# EAGLE design Hazard Beacon Timer (EAGLE 9.6.2)
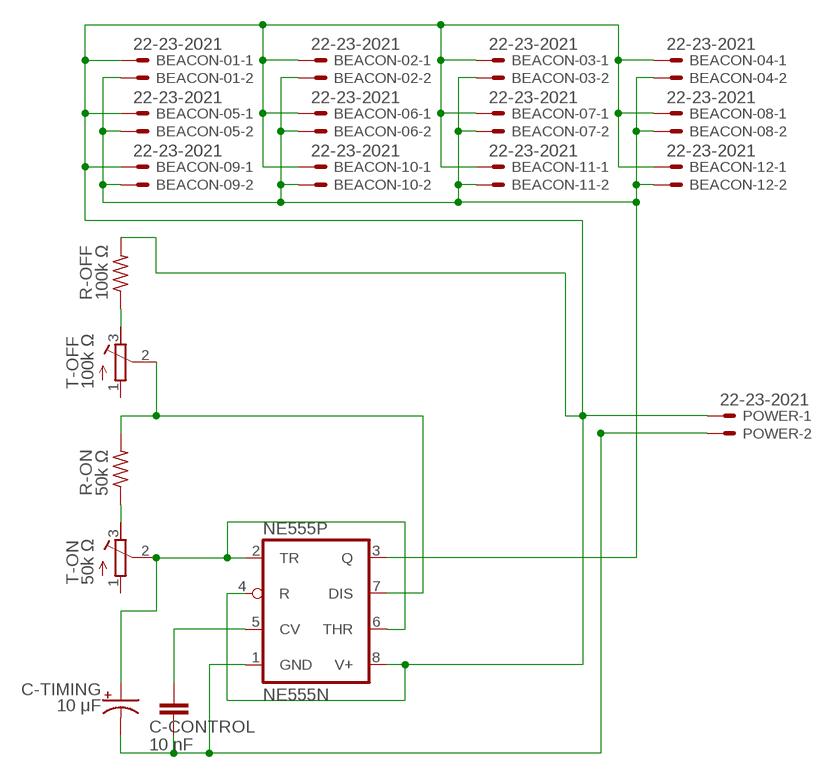
[diagram p0: schematic, sheet 1]

## Parts
BEACON-01  22-23-2021  [22-23-2021]
BEACON-02  22-23-2021  [22-23-2021]
BEACON-03  22-23-2021  [22-23-2021]
BEACON-04  22-23-2021  [22-23-2021]
BEACON-05  22-23-2021  [22-23-2021]
BEACON-06  22-23-2021  [22-23-2021]
BEACON-07  22-23-2021  [22-23-2021]
BEACON-08  22-23-2021  [22-23-2021]
BEACON-09  22-23-2021  [22-23-2021]
BEACON-10  22-23-2021  [22-23-2021]
BEACON-11  22-23-2021  [22-23-2021]
BEACON-12  22-23-2021  [22-23-2021]
C-CONTROL  10 nF  C2.5/2  [C2.5-2]
C-TIMING  10 μF  CPOL-USE2-5  [E2-5]
NE555P  NE555N  [DIL08]
POWER  22-23-2021  [22-23-2021]
R-OFF  100k Ω  R-US_0207/7  [0207/7]
R-ON  50k Ω  R-US_0207/7  [0207/7]
T-OFF  100k Ω  R-TRIMM5X  [RTRIM5X]
T-ON  50k Ω  R-TRIMM5X  [RTRIM5X]

## Nets
N$1: C-CONTROL.1 NE555P.5(CV)
N$2: R-ON.1 T-ON.3(E)
N$3: NE555P.7(DIS) R-ON.2 T-OFF.2(S)
N$4: BEACON-01.1 BEACON-02.1 BEACON-03.1 BEACON-04.1 BEACON-05.1 BEACON-06.1 BEACON-07.1 BEACON-08.1 BEACON-09.1 BEACON-10.1 BEACON-11.1 BEACON-12.1 NE555P.4(R) NE555P.8(V+) POWER.1 R-OFF.2
N$5: R-OFF.1 T-OFF.3(E)
N$7: BEACON-01.2 BEACON-02.2 BEACON-03.2 BEACON-04.2 BEACON-05.2 BEACON-06.2 BEACON-07.2 BEACON-08.2 BEACON-09.2 BEACON-10.2 BEACON-11.2 BEACON-12.2 NE555P.3(Q)
N$8: C-TIMING.+ NE555P.2(TR) NE555P.6(THR) T-ON.2(S)
N$11: C-CONTROL.2 C-TIMING.- NE555P.1(GND) POWER.2
Unconnected: T-OFF.1(A) T-ON.1(A)

## Library data of the parts
BEACON-01-BEACON-09 BEACON-10-BEACON-12 POWER = con-molex:22-23-2021: .100" (2.54mm) Center Header - 2 Pin; MF: MOLEX; MPN: 22-23-2021; OC_FARNELL: 1462926; OC_NEWARK: 25C3832
C-CONTROL = capacitor-wima:C: CAPACITOR naming: grid - package width
C-TIMING = rcl:CPOL-US: POLARIZED CAPACITOR, American symbol; SPICEPREFIX: C
NE555P = linear:*555: TIMER
R-OFF R-ON = rcl:R-US_: RESISTOR, American symbol; SPICEPREFIX: R
T-OFF T-ON = rcl:R-TRIMM: Trimm resistor; SPICEMODEL: X; SPICEPREFIXL: POT

## Board
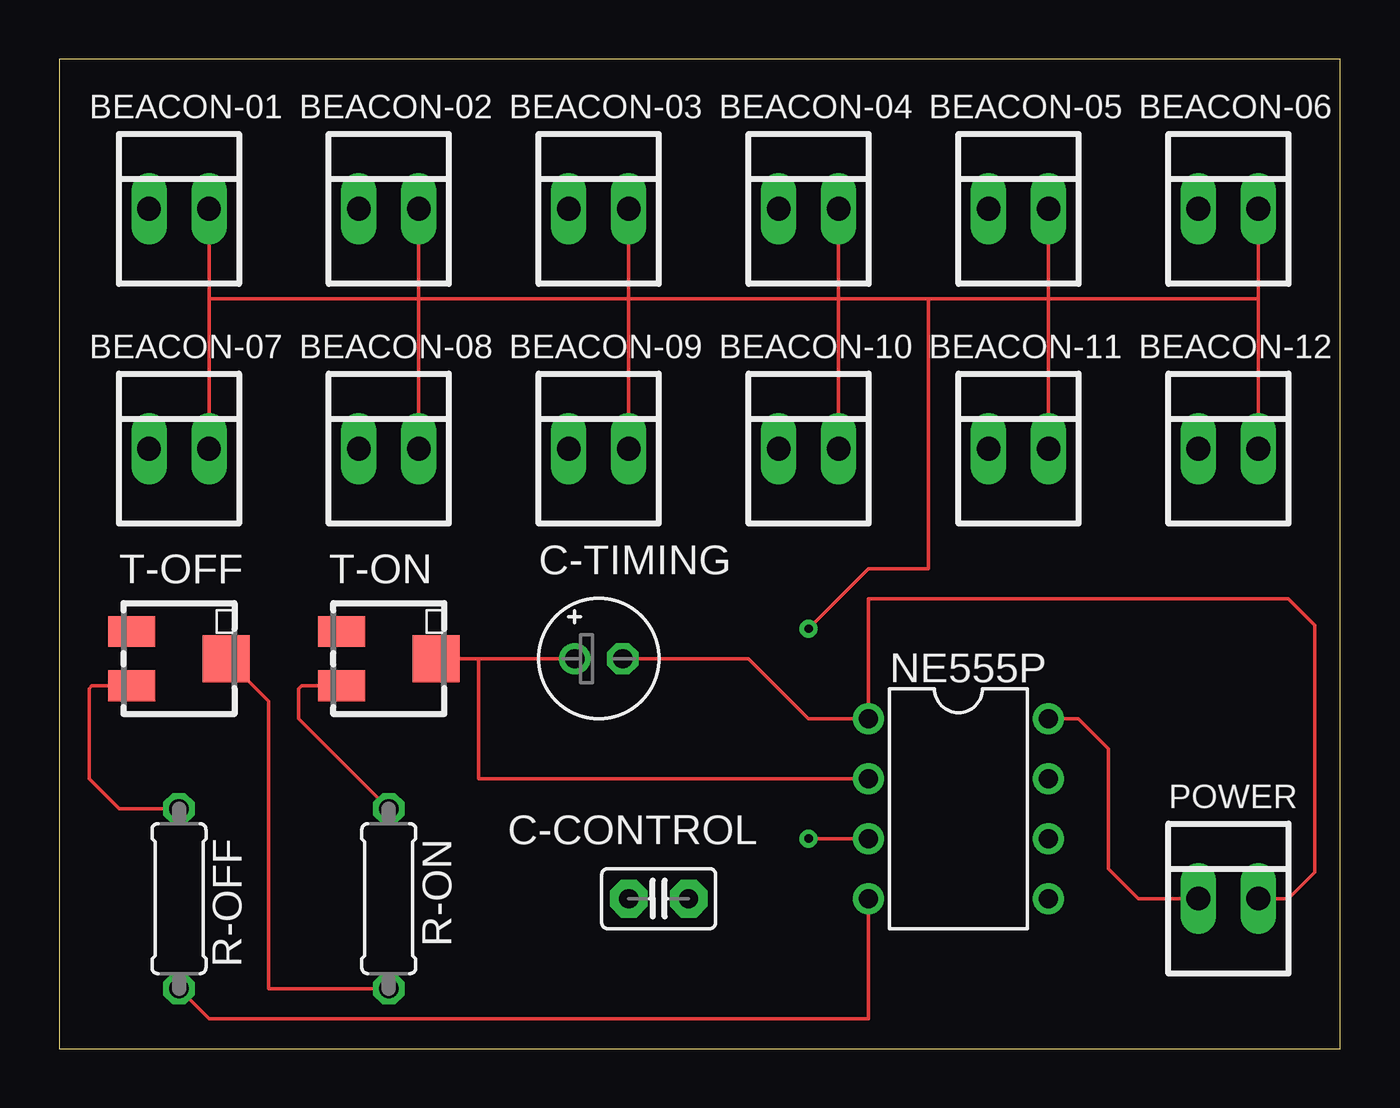
[diagram p1: board, top side]
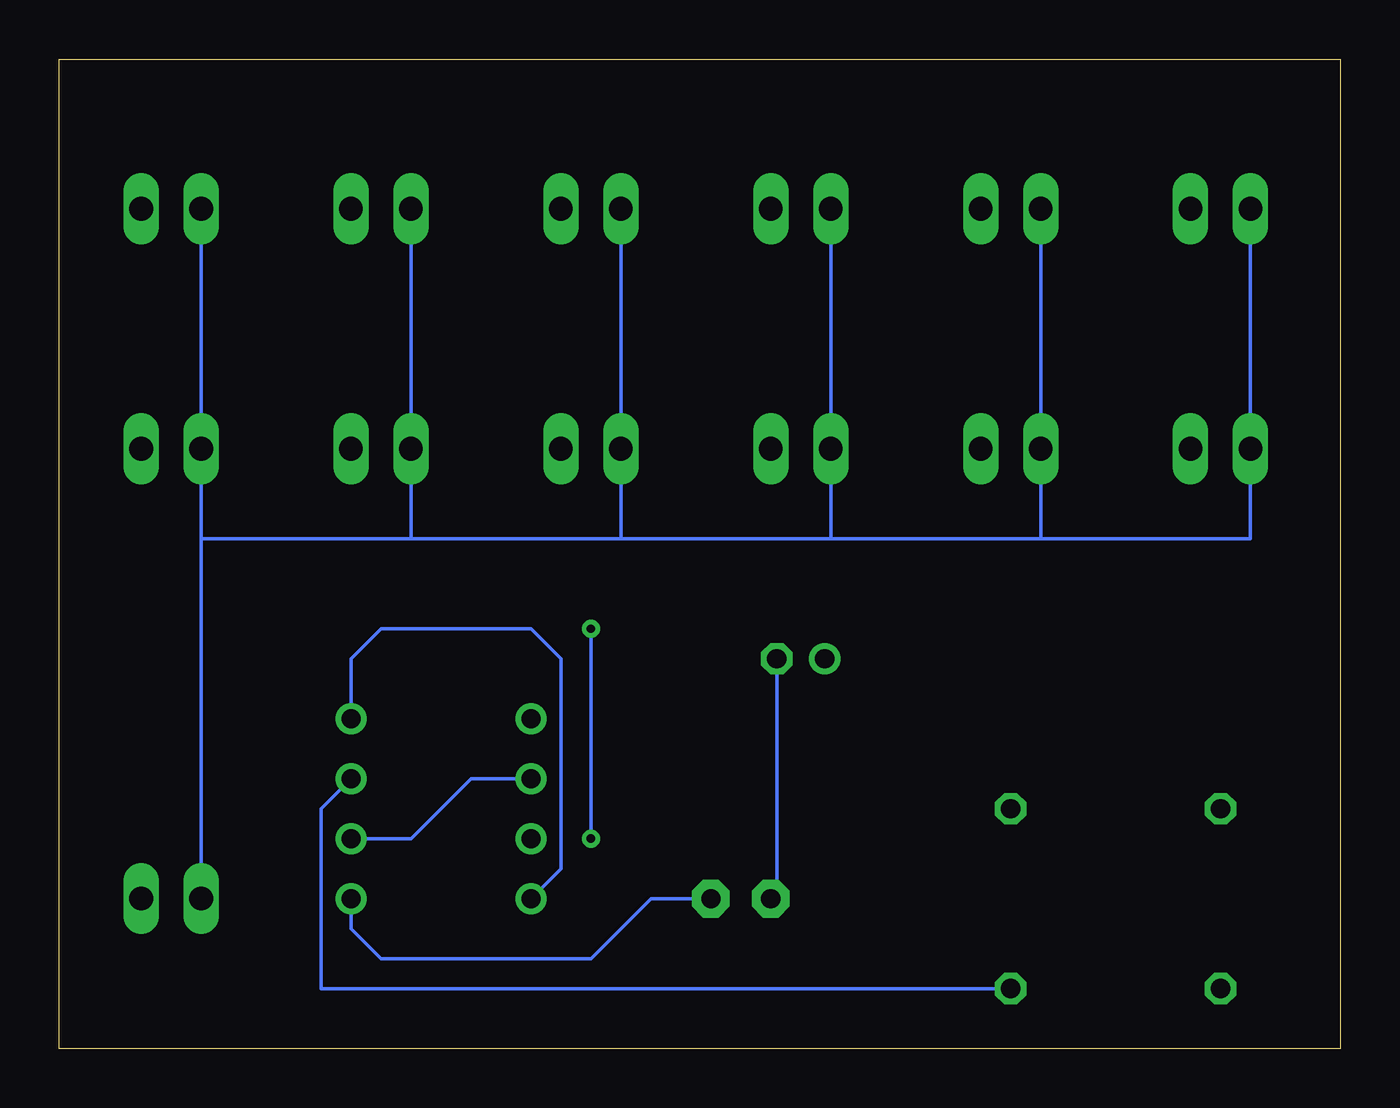
[diagram p2: board, bottom side, seen from below]

Size 54.28 x 41.9 mm. Coordinates in mm from the lower left corner, seen from the top.
Outline: 0,0 54.28,0 54.28,41.9 0,41.9 0,0
Copper layers (1*16): Top 0.035mm / dielectric 1.5mm / Bottom 0.035mm
Design rules "default": minimum track width 6mil, minimum drill 0.35mm, track to track 6mil, track to pad 6mil, pad to pad 6mil, via to via 6mil, smd to smd 6mil, copper to edge 40mil, drill to drill 6mil, minimum pad ring 10mil, minimum via ring 8mil, stop-mask expansion 4mil, vias tented up to drill 0mil, thermal gap 10mil

### Footprints (pad centres in the part's own frame; a part is rotated, then mirrored left to right if it is on the bottom)
22-23-2021 = drill 1 long: 1 -1.27,0; 2 1.27,0
C2.5-2 = drill 0.813 pad 1.6 octagon: 1 -1.27,0; 2 1.27,0
E2-5 = drill 0.813 pad 1.27: + -1.016,0 | drill 0.813 pad 1.27 octagon: - 1.016,0
DIL08 = drill 0.813 pad 1.27: 1 -3.81,-3.81; 2 -1.27,-3.81; 3 1.27,-3.81; 4 3.81,-3.81; 5 3.81,3.81; 6 1.27,3.81; 7 -1.27,3.81; 8 -3.81,3.81
0207/7 = drill 0.813 octagon: 1 -3.81,0; 2 3.81,0
RTRIM5X = smd 1.3 x 2: 1 -1.15,-2; 3 1.15,-2 | smd 2 x 2: 2 0,2

### Placement (x,y rotation side)
BEACON-01  5.08,35.56 0 top
BEACON-02  13.97,35.56 0 top
BEACON-03  22.86,35.56 0 top
BEACON-04  31.75,35.56 0 top
BEACON-05  40.64,35.56 0 top
BEACON-06  49.53,35.56 0 top
BEACON-07  5.08,25.4 0 top
BEACON-08  13.97,25.4 0 top
BEACON-09  22.86,25.4 0 top
BEACON-10  31.75,25.4 0 top
BEACON-11  40.64,25.4 0 top
BEACON-12  49.53,25.4 0 top
C-CONTROL  25.4,6.35 180 top
C-TIMING  22.86,16.51 0 top
NE555P  38.1,10.16 270 top
POWER  49.53,6.35 0 top
R-OFF  5.08,6.35 270 top
R-ON  13.97,6.35 270 top
T-OFF  5.08,16.51 270 top
T-ON  13.97,16.51 270 top

### Tracks (layer width: path | path; a pad name or v marks a point on that pad's centre or on a via)
N$1
  Bottom 0.152: C-CONTROL.1 29.21,6.35 31.75,3.81 40.64,3.81 41.91,5.08 NE555P.5
N$2
  Top 0.152: R-ON.1 10.16,13.97 10.16,15.24 10.28,15.36 T-ON.3
N$3
  Top 0.152: T-OFF.2 8.89,14.7 8.89,2.54 R-ON.2
  Bottom 0.152: R-ON.2 43.18,2.54 43.18,10.16 NE555P.7
N$4
  Top 0.152: R-OFF.2 6.35,1.27 34.29,1.27 NE555P.4 | POWER.1 45.72,6.35 44.45,7.62 44.45,12.7 43.18,13.97 NE555P.8
  Bottom 0.152: NE555P.4 33.02,7.62 33.02,16.51 34.29,17.78 40.64,17.78 41.91,16.51 NE555P.8 | POWER.1 48.26,21.59 | 48.26,21.59 39.37,21.59 | 39.37,21.59 30.48,21.59 | 30.48,21.59 21.59,21.59 | 21.59,21.59 12.7,21.59 | 12.7,21.59 3.81,21.59 BEACON-07.1 BEACON-01.1 | 12.7,21.59 BEACON-08.1 BEACON-02.1 | 21.59,21.59 BEACON-09.1 BEACON-03.1 | 30.48,21.59 BEACON-10.1 BEACON-04.1 | 39.37,21.59 BEACON-11.1 BEACON-05.1 | 48.26,21.59 BEACON-12.1 BEACON-06.1
N$5
  Top 0.152: R-OFF.1 2.54,10.16 1.27,11.43 1.27,15.24 1.39,15.36 T-OFF.3
N$7  (via drill 0.35)
  Top 0.152: NE555P.3 v31.75,8.89 | v31.75,17.78 34.29,20.32 36.83,20.32 36.83,31.75 | 36.83,31.75 41.91,31.75 | BEACON-06.2 BEACON-12.2 50.8,31.75 45.72,31.75 41.91,31.75 | 41.91,31.75 BEACON-11.2 BEACON-05.2 | 33.02,31.75 36.83,31.75 | BEACON-04.2 BEACON-10.2 33.02,31.75 | 33.02,31.75 24.13,31.75 | BEACON-03.2 BEACON-09.2 24.13,31.75 | 15.24,31.75 BEACON-08.2 BEACON-02.2 | 24.13,31.75 15.24,31.75 | 15.24,31.75 6.35,31.75 BEACON-07.2 BEACON-01.2
  Bottom 0.152: v31.75,8.89 v31.75,17.78
N$8
  Top 0.152: T-ON.2 17.78,16.51 | 17.78,16.51 C-TIMING.+ | NE555P.2 17.78,11.43 17.78,16.51
  Bottom 0.152: NE555P.6 39.37,8.89 36.83,11.43 NE555P.2
N$11
  Top 0.152: POWER.2 52.07,6.35 53.19,7.47 53.19,17.93 52.07,19.05 34.29,19.05 NE555P.1 31.75,13.97 29.21,16.51 C-TIMING.-
  Bottom 0.152: C-TIMING.- 23.88,6.6 C-CONTROL.2